# Altium schematic sheet IO1.SchDoc
size 400 x 241 mm; SheetNumber: 1; SheetTotal: 7
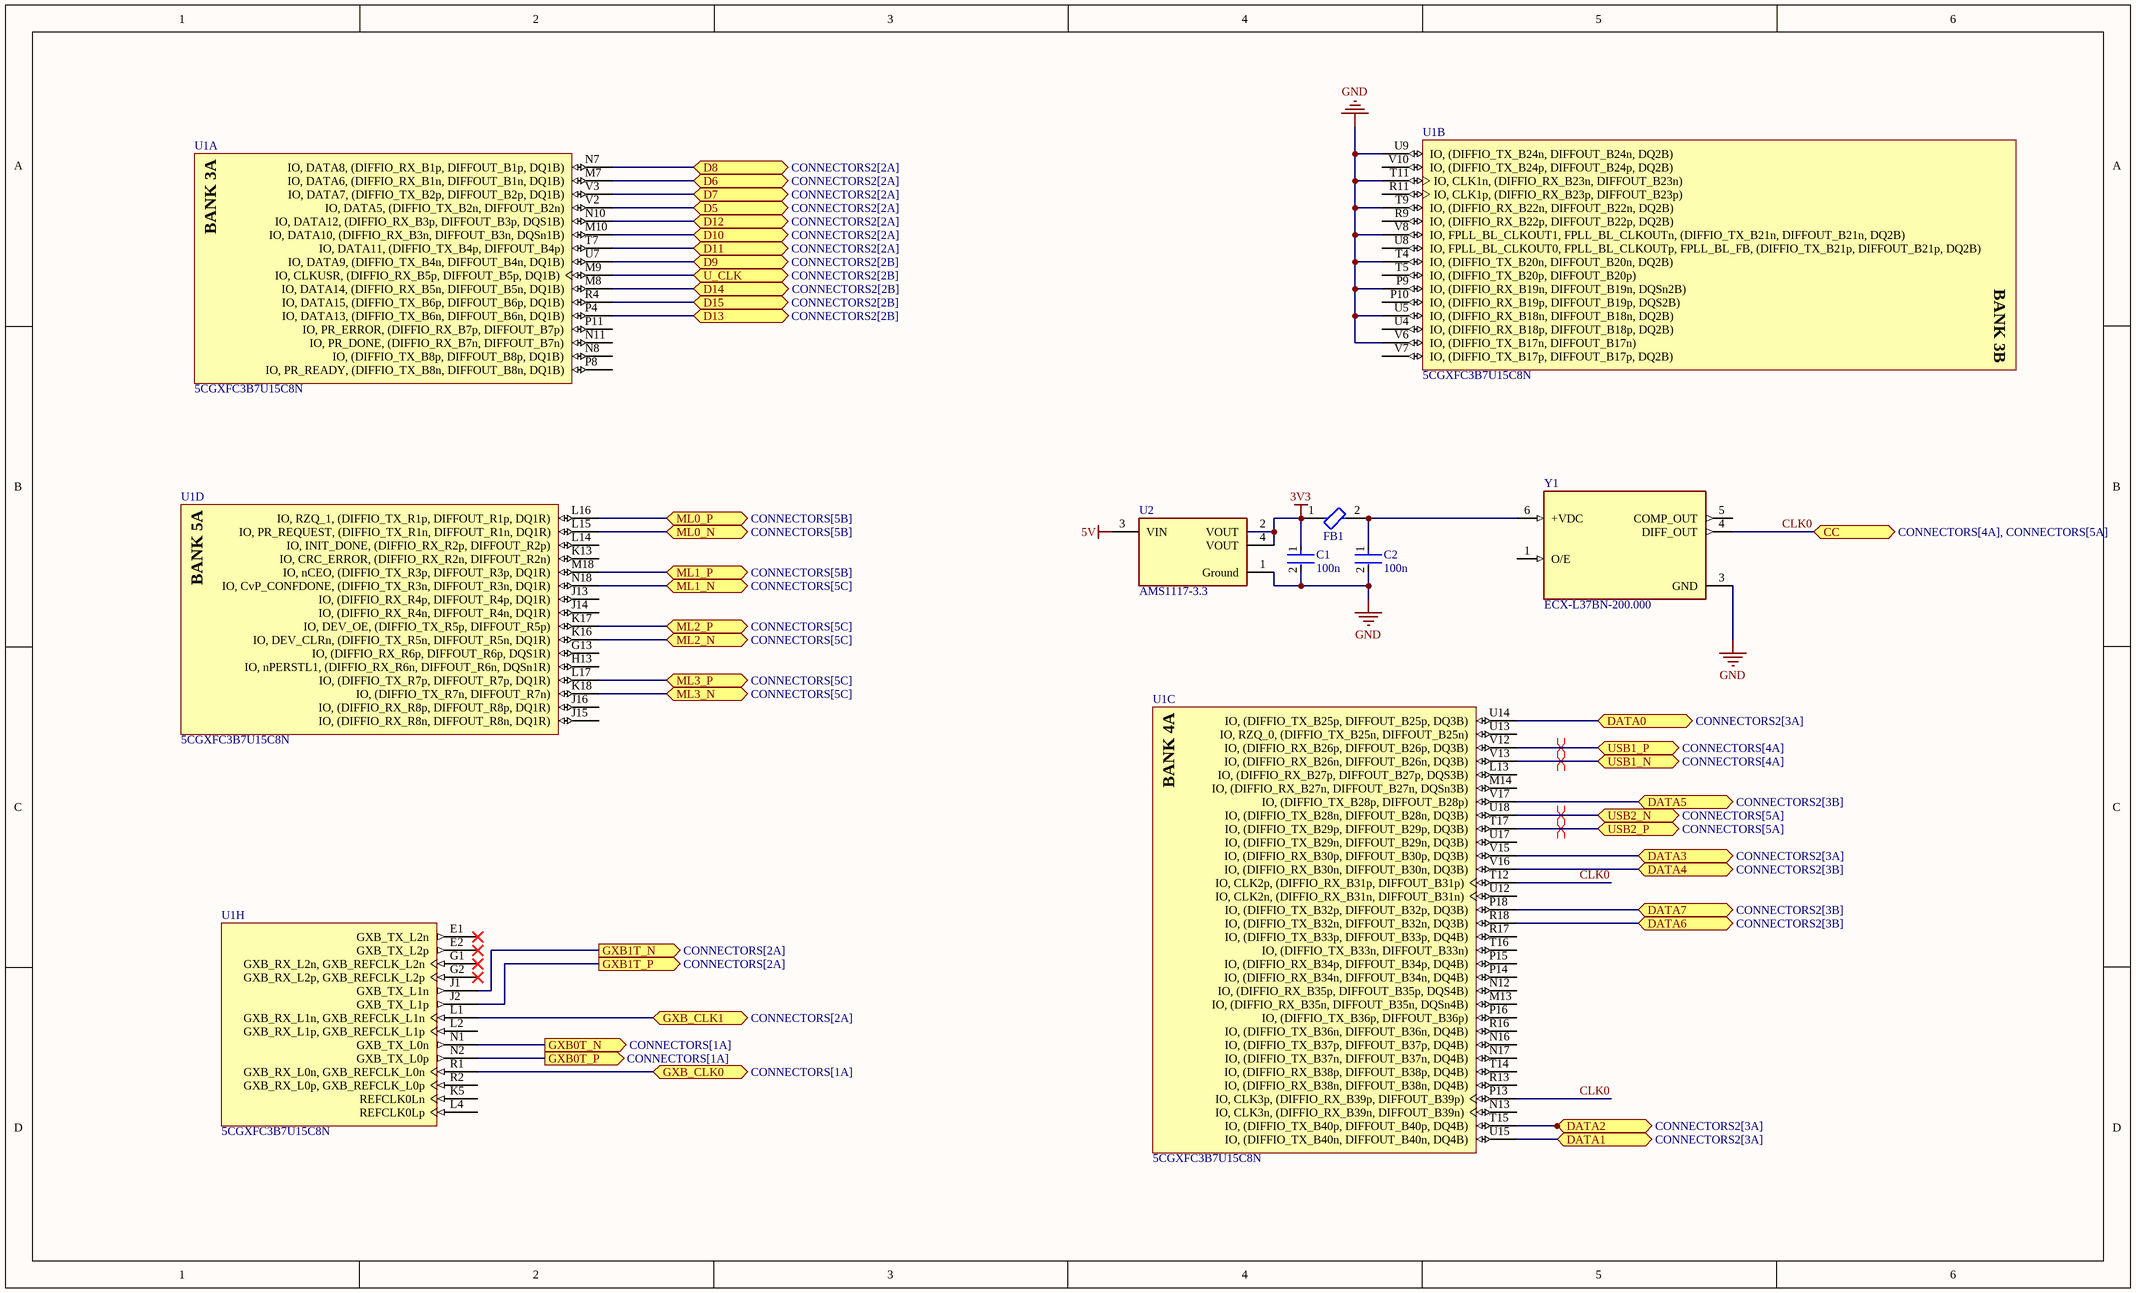
[diagram p0: IO1.SchDoc]

## Parts
C1  100n  [FP-CL10-IPC_C]
C2  100n  [FP-CL10-IPC_C]
FB1  BLM18KG121TN1D  [FP-BLM18-0_15-t0_6-d1_2-IPC_A]  (value not drawn)
U1  5CGXFC3B7U15C8N  [ALTR-UBGA324_A-150]  (parts A,B,C,D,H of 12)
U2  AMS1117-3.3  [FP-AMS1117-IPC_C]
Y1  ECX-L37BN-200.000  [OSC_ECX-L37BN-200.000]

## Ports
CC (bidir, see CONNECTORS[4A], CONNECTORS[5A]), D5 (bidir, see CONNECTORS2[2A]), D6 (bidir, see CONNECTORS2[2A]), D7 (bidir, see CONNECTORS2[2A]), D8 (bidir, see CONNECTORS2[2A]), D9 (bidir, see CONNECTORS2[2B]), D10 (bidir, see CONNECTORS2[2A]), D11 (bidir, see CONNECTORS2[2A]), D12 (bidir, see CONNECTORS2[2A]), D13 (bidir, see CONNECTORS2[2B]), D14 (bidir, see CONNECTORS2[2B]), D15 (bidir, see CONNECTORS2[2B]), DATA0 (bidir, see CONNECTORS2[3A]), DATA1 (bidir, see CONNECTORS2[3A]), DATA2 (bidir, see CONNECTORS2[3A]), DATA3 (bidir, see CONNECTORS2[3A]), DATA4 (bidir, see CONNECTORS2[3B]), DATA5 (bidir, see CONNECTORS2[3B]), DATA6 (bidir, see CONNECTORS2[3B]), DATA7 (bidir, see CONNECTORS2[3B]), GXB0T_N (out, see CONNECTORS[1A]), GXB0T_P (out, see CONNECTORS[1A]), GXB1T_N (out, see CONNECTORS[2A]), GXB1T_P (out, see CONNECTORS[2A]), GXB_CLK0 (bidir, see CONNECTORS[1A]), GXB_CLK1 (bidir, see CONNECTORS[2A]), ML0_N (bidir, see CONNECTORS[5B]), ML0_P (bidir, see CONNECTORS[5B]), ML1_N (bidir, see CONNECTORS[5C]), ML1_P (bidir, see CONNECTORS[5B]), ML2_N (bidir, see CONNECTORS[5C]), ML2_P (bidir, see CONNECTORS[5C]), ML3_N (bidir, see CONNECTORS[5C]), ML3_P (bidir, see CONNECTORS[5C]), U_CLK (bidir, see CONNECTORS2[2B]), USB1_N (bidir, see CONNECTORS[4A]), USB1_P (bidir, see CONNECTORS[4A]), USB2_N (bidir, see CONNECTORS[5A]), USB2_P (bidir, see CONNECTORS[5A])

## Nets
3V3: C1.1 FB1.1 U2.2(VOUT) U2.4(VOUT)
5V: U2.3(VIN)
GND: C1.2 C2.2 U1.P9(IO,_(DIFFIO_RX_B19n,_DIFFOUT_B19n,_DQSn2B)) U1.T4(IO,_(DIFFIO_TX_B20n,_DIFFOUT_B20n,_DQ2B)) U1.T9(IO,_(DIFFIO_RX_B22n,_DIFFOUT_B22n,_DQ2B)) U1.T11(IO,_CLK1n,_(DIFFIO_RX_B23n,_DIFFOUT_B23n)) U1.U5(IO,_(DIFFIO_RX_B18n,_DIFFOUT_B18n,_DQ2B)) U1.U9(IO,_(DIFFIO_TX_B24n,_DIFFOUT_B24n,_DQ2B)) U1.V6(IO,_(DIFFIO_TX_B17n,_DIFFOUT_B17n)) U1.V8(IO,_FPLL_BL_CLKOUT1,_FPLL_BL_CLKOUTn,_(DIFFIO_TX_B21n,_DIFFOUT_B21n,_DQ2B)) U2.1(Ground) Y1.3(GND)
CLK0: U1.P13(IO,_CLK3p,_(DIFFIO_RX_B39p,_DIFFOUT_B39p)) U1.T12(IO,_CLK2p,_(DIFFIO_RX_B31p,_DIFFOUT_B31p)) Y1.4(DIFF_OUT) ; port CC
D5: U1.V2(IO,_DATA5,_(DIFFIO_TX_B2n,_DIFFOUT_B2n)) ; port D5
D6: U1.M7(IO,_DATA6,_(DIFFIO_RX_B1n,_DIFFOUT_B1n,_DQ1B)) ; port D6
D7: U1.V3(IO,_DATA7,_(DIFFIO_TX_B2p,_DIFFOUT_B2p,_DQ1B)) ; port D7
D8: U1.N7(IO,_DATA8,_(DIFFIO_RX_B1p,_DIFFOUT_B1p,_DQ1B)) ; port D8
D9: U1.U7(IO,_DATA9,_(DIFFIO_TX_B4n,_DIFFOUT_B4n,_DQ1B)) ; port D9
D10: U1.M10(IO,_DATA10,_(DIFFIO_RX_B3n,_DIFFOUT_B3n,_DQSn1B)) ; port D10
D11: U1.T7(IO,_DATA11,_(DIFFIO_TX_B4p,_DIFFOUT_B4p)) ; port D11
D12: U1.N10(IO,_DATA12,_(DIFFIO_RX_B3p,_DIFFOUT_B3p,_DQS1B)) ; port D12
D13: U1.P4(IO,_DATA13,_(DIFFIO_TX_B6n,_DIFFOUT_B6n,_DQ1B)) ; port D13
D14: U1.M8(IO,_DATA14,_(DIFFIO_RX_B5n,_DIFFOUT_B5n,_DQ1B)) ; port D14
D15: U1.R4(IO,_DATA15,_(DIFFIO_TX_B6p,_DIFFOUT_B6p,_DQ1B)) ; port D15
DATA0: U1.U14(IO,_(DIFFIO_TX_B25p,_DIFFOUT_B25p,_DQ3B)) ; port DATA0
DATA1: U1.U15(IO,_(DIFFIO_TX_B40n,_DIFFOUT_B40n,_DQ4B)) ; port DATA1
DATA2: U1.T15(IO,_(DIFFIO_TX_B40p,_DIFFOUT_B40p,_DQ4B)) ; port DATA2
DATA3: U1.V15(IO,_(DIFFIO_RX_B30p,_DIFFOUT_B30p,_DQ3B)) ; port DATA3
DATA4: U1.V16(IO,_(DIFFIO_RX_B30n,_DIFFOUT_B30n,_DQ3B)) ; port DATA4
DATA5: U1.V17(IO,_(DIFFIO_TX_B28p,_DIFFOUT_B28p)) ; port DATA5
DATA6: U1.R18(IO,_(DIFFIO_TX_B32n,_DIFFOUT_B32n,_DQ3B)) ; port DATA6
DATA7: U1.P18(IO,_(DIFFIO_TX_B32p,_DIFFOUT_B32p,_DQ3B)) ; port DATA7
GXB0T_N: U1.N1(GXB_TX_L0n) ; port GXB0T_N
GXB0T_P: U1.N2(GXB_TX_L0p) ; port GXB0T_P
GXB1T_N: U1.J1(GXB_TX_L1n) ; port GXB1T_N
GXB1T_P: U1.J2(GXB_TX_L1p) ; port GXB1T_P
GXB_CLK0: U1.R1(GXB_RX_L0n,_GXB_REFCLK_L0n) ; port GXB_CLK0
GXB_CLK1: U1.L1(GXB_RX_L1n,_GXB_REFCLK_L1n) ; port GXB_CLK1
ML0_N: U1.L15(IO,_PR_REQUEST,_(DIFFIO_TX_R1n,_DIFFOUT_R1n,_DQ1R)) ; port ML0_N
ML0_P: U1.L16(IO,_RZQ_1,_(DIFFIO_TX_R1p,_DIFFOUT_R1p,_DQ1R)) ; port ML0_P
ML1_N: U1.N18(IO,_CvP_CONFDONE,_(DIFFIO_TX_R3n,_DIFFOUT_R3n,_DQ1R)) ; port ML1_N
ML1_P: U1.M18(IO,_nCEO,_(DIFFIO_TX_R3p,_DIFFOUT_R3p,_DQ1R)) ; port ML1_P
ML2_N: U1.K16(IO,_DEV_CLRn,_(DIFFIO_TX_R5n,_DIFFOUT_R5n,_DQ1R)) ; port ML2_N
ML2_P: U1.K17(IO,_DEV_OE,_(DIFFIO_TX_R5p,_DIFFOUT_R5p)) ; port ML2_P
ML3_N: U1.K18(IO,_(DIFFIO_TX_R7n,_DIFFOUT_R7n)) ; port ML3_N
ML3_P: U1.L17(IO,_(DIFFIO_TX_R7p,_DIFFOUT_R7p,_DQ1R)) ; port ML3_P
U_CLK: U1.M9(IO,_CLKUSR,_(DIFFIO_RX_B5p,_DIFFOUT_B5p,_DQ1B)) ; port U_CLK
USB1_N: U1.V13(IO,_(DIFFIO_RX_B26n,_DIFFOUT_B26n,_DQ3B)) ; port USB1_N
USB1_P: U1.V12(IO,_(DIFFIO_RX_B26p,_DIFFOUT_B26p,_DQ3B)) ; port USB1_P
USB2_N: U1.U18(IO,_(DIFFIO_TX_B28n,_DIFFOUT_B28n,_DQ3B)) ; port USB2_N
USB2_P: U1.T17(IO,_(DIFFIO_TX_B29p,_DIFFOUT_B29p,_DQ3B)) ; port USB2_P
NetC2_1: C2.1 FB1.2 Y1.6(+VDC)

Not connected (* = marked no-connect by the designer): U1 E1(GXB_TX_L2n)* E2(GXB_TX_L2p)* G1(GXB_RX_L2n,_GXB_REFCLK_L2n)* G2(GXB_RX_L2p,_GXB_REFCLK_L2p)* G13(IO,_(DIFFIO_RX_R6p,_DIFFOUT_R6p,_DQS1R)) H13(IO,_nPERSTL1,_(DIFFIO_RX_R6n,_DIFFOUT_R6n,_DQSn1R)) J13(IO,_(DIFFIO_RX_R4p,_DIFFOUT_R4p,_DQ1R)) J14(IO,_(DIFFIO_RX_R4n,_DIFFOUT_R4n,_DQ1R)) J15(IO,_(DIFFIO_RX_R8n,_DIFFOUT_R8n,_DQ1R)) J16(IO,_(DIFFIO_RX_R8p,_DIFFOUT_R8p,_DQ1R)) K5(REFCLK0Ln) K13(IO,_CRC_ERROR,_(DIFFIO_RX_R2n,_DIFFOUT_R2n)) L2(GXB_RX_L1p,_GXB_REFCLK_L1p) L4(REFCLK0Lp) L13(IO,_(DIFFIO_RX_B27p,_DIFFOUT_B27p,_DQS3B)) L14(IO,_INIT_DONE,_(DIFFIO_RX_R2p,_DIFFOUT_R2p)) M13(IO,_(DIFFIO_RX_B35n,_DIFFOUT_B35n,_DQSn4B)) M14(IO,_(DIFFIO_RX_B27n,_DIFFOUT_B27n,_DQSn3B)) N8(IO,_(DIFFIO_TX_B8p,_DIFFOUT_B8p,_DQ1B)) N11(IO,_PR_DONE,_(DIFFIO_RX_B7n,_DIFFOUT_B7n)) N12(IO,_(DIFFIO_RX_B35p,_DIFFOUT_B35p,_DQS4B)) N13(IO,_CLK3n,_(DIFFIO_RX_B39n,_DIFFOUT_B39n)) N16(IO,_(DIFFIO_TX_B37p,_DIFFOUT_B37p,_DQ4B)) N17(IO,_(DIFFIO_TX_B37n,_DIFFOUT_B37n,_DQ4B)) P8(IO,_PR_READY,_(DIFFIO_TX_B8n,_DIFFOUT_B8n,_DQ1B)) P10(IO,_(DIFFIO_RX_B19p,_DIFFOUT_B19p,_DQS2B)) P11(IO,_PR_ERROR,_(DIFFIO_RX_B7p,_DIFFOUT_B7p)) P14(IO,_(DIFFIO_RX_B34n,_DIFFOUT_B34n,_DQ4B)) P15(IO,_(DIFFIO_RX_B34p,_DIFFOUT_B34p,_DQ4B)) P16(IO,_(DIFFIO_TX_B36p,_DIFFOUT_B36p)) R2(GXB_RX_L0p,_GXB_REFCLK_L0p) R9(IO,_(DIFFIO_RX_B22p,_DIFFOUT_B22p,_DQ2B)) R11(IO,_CLK1p,_(DIFFIO_RX_B23p,_DIFFOUT_B23p)) R13(IO,_(DIFFIO_RX_B38n,_DIFFOUT_B38n,_DQ4B)) R16(IO,_(DIFFIO_TX_B36n,_DIFFOUT_B36n,_DQ4B)) R17(IO,_(DIFFIO_TX_B33p,_DIFFOUT_B33p,_DQ4B)) T5(IO,_(DIFFIO_TX_B20p,_DIFFOUT_B20p)) T14(IO,_(DIFFIO_RX_B38p,_DIFFOUT_B38p,_DQ4B)) T16(IO,_(DIFFIO_TX_B33n,_DIFFOUT_B33n)) U4(IO,_(DIFFIO_RX_B18p,_DIFFOUT_B18p,_DQ2B)) U8(IO,_FPLL_BL_CLKOUT0,_FPLL_BL_CLKOUTp,_FPLL_BL_FB,_(DIFFIO_TX_B21p,_DIFFOUT_B21p,_DQ2B)) U12(IO,_CLK2n,_(DIFFIO_RX_B31n,_DIFFOUT_B31n)) U13(IO,_RZQ_0,_(DIFFIO_TX_B25n,_DIFFOUT_B25n)) U17(IO,_(DIFFIO_TX_B29n,_DIFFOUT_B29n,_DQ3B)) V7(IO,_(DIFFIO_TX_B17p,_DIFFOUT_B17p,_DQ2B)) V10(IO,_(DIFFIO_TX_B24p,_DIFFOUT_B24p,_DQ2B)); Y1 1(O/E) 5(COMP_OUT)

## Layout directives
differential pair: USB1_N, USB1_P, USB2_N, USB2_P

## Notes on the sheet
- (in symbol CMP-0469-00059-2, part A) BANK 3A
- (in symbol CMP-0469-00059-2, part B) BANK 3B
- (in symbol CMP-0469-00059-2, part C) BANK 4A
- (in symbol CMP-0469-00059-2, part D) BANK 5A

## Library data of the parts
C1 C2 = CMP-13271-003017-1: Cap Ceramic 4.7uF 10V X5R ±10% Pad SMD 0603 +85°C T/R; Capacitance: 4.7uF; Case/Package: 0603; Packaging: Tape and Reel; Width: 0.031inch; Contact Plating: Tin; Thickness: 0.035inch; Package Quantity: 1; Voltage Rating: 10V; Case Code (Metric): 1608; Case Code (Imperial): 0603; Depth: 0.8mm; Height: 0.8mm; Tolerance: 10%; Max Operating Temperature: 85°C; Length: 1.6mm; Dielectric: X5R; Mount: Surface Mount; Radiation Hardening: No; Min Operating Temperature: -55°C
FB1 = CMP-0686-00554-8: FERRITE BEAD 120 OHM 0603 1LN; Max Current Rating: 3A; DC Resistance (DCR): 30mR; Impedance: 120R; Number of Lines: 1; Test Frequency: 100MHz; Tolerance: 25%; Package Quantity: 4000; Min Operating Temperature: -55°C; Termination: SMD/SMT; REACH SVHC: No SVHC; Core Material: Ferrite; Material: Ferrite; Current Rating: 3A; Height: 0.8mm; Number of Pins: 2; Case/Package: 0603; Case Code (Imperial): 0603; Series: BLM18K; Packaging: Tape and Reel; Inductor Type: FERRITE BEAD; Lead Free: Lead Free; Width: 0.8mm; Case Code (Metric): 1608; Number of Circuits: 1; Max DC Current: 3A; Depth: 0.95mm; Max Operating Temperature: 125°C; Length: 1.6mm; RoHS Compliant: Yes
U1 = CMP-0469-00059-2: Cyclone V GX Family FPGA, 1.07 to 1.13 V Supply, 144 I/O Pins, 4 PLLs, 324-Pin UBGA, Speed Grade 8, Commercial Grade, RoHS Compliant; Manufacturer: Altera; Logic Elements (LE) (K): 31.5; GPIO: 144; Speed Grade: 8; ComponentLink1Description: Manufacturer URL; ComponentLink5URL: http://www.altera.com/literature/dp/cyclone-v/5CGXFC3.xls; ComponentLink7URL: http://www.buyaltera.com/scripts/partsearch.dll?Detail&name=544-2758-ND; Subcategory: Cyclone V GX; ComponentLink2Description: Datasheet; Voltage Supply: 1.07 to 1.13 V; PackageVersion: Rev. 1.0, 10/2011; ComponentLink7Description: Product URL; ComponentLink4Description: Device Handbook URL; Mounting Technology: Surface Mount; ComponentLink3URL: http://www.altera.com/devicepackaging/04R00433-00.pdf; Code_JEDEC: MO-216-BAK-1; ComponentLink1URL: http://www.altera.com; ComponentLink3Description: Package Specification; Device Group: 5CGXFC3; ComponentLink6URL: http://www.altera.com/literature/hb/cyclone-v/cv_51001.pdf; ComponentLink4URL: http://www.altera.com/literature/hb/cyclone-v/cyclone5_handbook.pdf; PackageDescription: 324-Pin Ultra FineLine Ball-Grid Array (UBGA), Body 15 x 15 mm, Pitch 0.8 mm; RoHS: RoHS Compliant; PackageReference: UBGA324_A-150; DatasheetVersion: Rev. 3.4; PartNumber: 5CGXFC3B7U15C8N; ComponentLink2URL: http://www.altera.com/literature/hb/cyclone-v/cv_51002.pdf; ComponentLink6Description: Device Overview URL; ComponentLink5Description: Device Pin-Out URL; NexusDeviceID: 5CGXFC3B7U15C8N
U2 = CMP-209535-000001-1: LDO Voltage Regulators 1A, 3.3V; Manufacturer: Advanced Monolithic Systems; Dropout Voltage: 1.1V; Output Type: Fixed; Nominal Supply Current: 5mA; Max Power Dissipation: 1.2W; Max Supply Voltage: 15V; Number Of Outputs: 1; Standoff Height: 0.64mm; Max Junction Temp: +125°C; Height: 1.8mm; Package: AMS1117; Device Class L2: Power Management ICs; ComponentLink2Description: Datasheet; ComponentLink2URL: http://www.advanced-monolithic.com/pdf/ds1117.pdf; Category: IC; RoHS: TRUE; Automotive: No; Device Class L1: Integrated Circuits (ICs); Output Current: 1A; Device Class L3: Voltage Regulators - Linear; Temperature: -40°C to +125°C; Output Voltage: 3.3V; Manufacturer Part Number: AMS1117-3.3; Temperature Range Low: -40°C; Octopart: https://octopart.com/ams1117-3.3-advanced+monolithic+systems-25899300; Lead Free: Yes; Ipc Land Pattern Name: SOT229P700X180-4; Temperature Range High: +125°C
Y1 = ECX-L37BN-200.000: 200 MHz XO (Standard) LVDS Oscillator 3.3V Enable/Disable 6-SMD, No Lead; MF: ECS Inc.; MP: ECX-L37BN-200.000; Package: SMD-6 ECS International; Purchase-URL: https://pricing.snapeda.com/search/part/ECX-L37BN-200.000/?ref=eda; Price: None; Value: *; SnapEDA_Link: https://www.snapeda.com/parts/ECX-L37BN-200.000/ECS+Inc./view-part/?ref=snap; Check_prices: https://www.snapeda.com/parts/ECX-L37BN-200.000/ECS+Inc./view-part/?ref=eda; Availability: In Stock